# Altium schematic sheet DCDC_2.SchDoc
size B
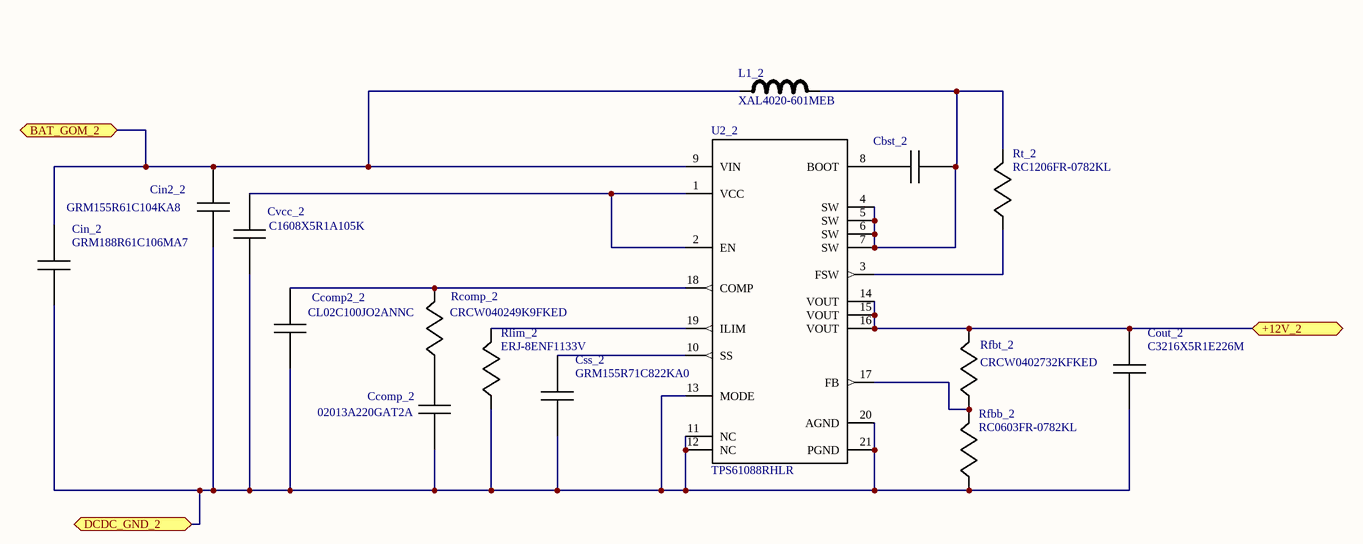
[diagram p0: DCDC_2.SchDoc]

## Parts
Cbst_2  C1005X5R1A104K  [1005]  (value not drawn)
Ccomp2_2  CL02C100JO2ANNC  [01005]
Ccomp_2  02013A220GAT2A  [0201]
Cin2_2  GRM155R61C104KA8  [0402]
Cin_2  GRM188R61C106MA7  [0603]
Cout_2  C3216X5R1E226M  [1206]
Css_2  GRM155R71C822KA0  [0402]
Cvcc_2  C1608X5R1A105K  [1608]
L1_2  XAL4020-601MEB  [XAL4020]
Rcomp_2  CRCW040249K9FKED  [0402]
Rfbb_2  RC0603FR-0782KL  [0603]
Rfbt_2  CRCW0402732KFKED  [0402]
Rlim_2  ERJ-8ENF1133V  [1206]
Rt_2  RC1206FR-0782KL  [1206]
U2_2  TPS61088RHLR  [RHL0020A]

## Ports
+12V_2 (bidir), BAT_GOM_2 (bidir), DCDC_GND_2 (bidir)

## Nets
+12V_2: Cout_2.1 Rfbt_2.1 U2_2.14(VOUT) U2_2.15(VOUT) U2_2.16(VOUT) ; port +12V_2
BAT_GOM_2: Cin2_2.1 Cin_2.1 L1_2.1 U2_2.9(VIN) ; port BAT_GOM_2
DCDC_GND_2: Ccomp2_2.1 Ccomp_2.2 Cin2_2.2 Cin_2.2 Cout_2.2 Css_2.1 Cvcc_2.1 Rfbb_2.2 Rlim_2.2 U2_2.11(NC) U2_2.12(NC) U2_2.13(MODE) U2_2.20(AGND) U2_2.21(PGND) ; port DCDC_GND_2
NetCbst_2_1: Cbst_2.1 L1_2.2 Rt_2.1 U2_2.4(SW) U2_2.5(SW) U2_2.6(SW) U2_2.7(SW)
NetCbst_2_2: Cbst_2.2 U2_2.8(BOOT)
NetCcomp2_2_2: Ccomp2_2.2 Rcomp_2.1 U2_2.18(COMP)
NetCcomp_2_1: Ccomp_2.1 Rcomp_2.2
NetCss_2_2: Css_2.2 U2_2.10(SS)
NetCvcc_2_2: Cvcc_2.2 U2_2.1(VCC) U2_2.2(EN)
NetRfbb_2_1: Rfbb_2.1 Rfbt_2.2 U2_2.17(FB)
NetRlim_2_1: Rlim_2.1 U2_2.19(ILIM)
NetRt_2_2: Rt_2.2 U2_2.3(FSW)

## Library data of the parts
Cbst_2 = C1005X5R1A104K: Imported; Vendor: TDK; Value: 100nF; Manufacturer_Part_Number: C1005X5R1A104K; RefDes: RefDes; TYPE: TYPE
Ccomp2_2 = CL02C100JO2ANNC: Imported; Vendor: Samsung Electro-Mechanics; Manufacturer_Part_Number: CL02C100JO2ANNC; RefDes: RefDes; TYPE: TYPE; Value: Value
Ccomp_2 = 02013A220GAT2A: Imported; Vendor: AVX; Manufacturer_Part_Number: 02013A220GAT2A; RefDes: RefDes; TYPE: TYPE; Value: Value
Cin2_2 = GRM155R61C104KA8: Imported; Manufacturer_Part_Number: GRM155R61C104KA88D; Vendor: MuRata; RefDes: RefDes; TYPE: TYPE; Value: Value
Cin_2 = GRM188R61C106MA7: Imported; Manufacturer_Part_Number: GRM188R61C106MA73D; Cap: 1.0E-5; ESR: 0; VDC: 16; Vendor: Murata; IRMS: 0; RefDes: RefDes; TYPE: TYPE; Value: Value
Cout_2 = C3216X5R1E226M: Imported; Vendor: TDK; Manufacturer_Part_Number: C3216X5R1E226M; RefDes: RefDes; TYPE: TYPE; Value: Value
Css_2 = GRM155R71C822KA0: Imported; Manufacturer_Part_Number: GRM155R71C822KA01D; Vendor: MuRata; RefDes: RefDes; TYPE: TYPE; Value: Value
Cvcc_2 = C1608X5R1A105K: Imported; Vendor: TDK; Manufacturer_Part_Number: C1608X5R1A105K; RefDes: RefDes; TYPE: TYPE; Value: Value
L1_2 = XAL4020-601MEB: Imported; Vendor: Coilcraft; Manufacturer_Part_Number: XAL4020-601MEB; RefDes: RefDes; TYPE: TYPE; Value: Value
Rcomp_2 = CRCW040249K9FKED: Imported; Res_ohm: 49900; Power_W: 0.063; PartNumber: CRCW040249K9FKED; RefDes: RefDes; TYPE: TYPE; Value: Value
Rfbb_2 = RC0603FR-0782KL: Imported; Vendor: Yageo America; Manufacturer_Part_Number: RC0603FR-0782KL; RefDes: RefDes; TYPE: TYPE; Value: Value
Rfbt_2 = CRCW0402732KFKED: Imported; Vendor: Vishay-Dale; Manufacturer_Part_Number: CRCW0402732KFKED; RefDes: RefDes; TYPE: TYPE; Value: Value
Rlim_2 = ERJ-8ENF1133V: Imported; Vendor: Panasonic; Manufacturer_Part_Number: ERJ-8ENF1133V; RefDes: RefDes; TYPE: TYPE; Value: Value
Rt_2 = RC1206FR-0782KL: Imported; Vendor: Yageo America; Manufacturer_Part_Number: RC1206FR-0782KL; RefDes: RefDes; TYPE: TYPE; Value: Value
U2_2 = TPS61088RHLR: Imported; Alternate PartNumber: TPS61088RHLT; Manufacturer: Texas Instruments; CompType: IC; PIN_COUNT: 21; Application_BuildNumber: *; PartNumber: TPS61088RHLR; PackageReference: RHL0020A; MountType: SMT; RoHS: Y; RefDes: RefDes; TYPE: TYPE; Value: Value; Manufacturer_Part_Number: TPS61088RHLR; Manufacturer_Name: Texas Instruments